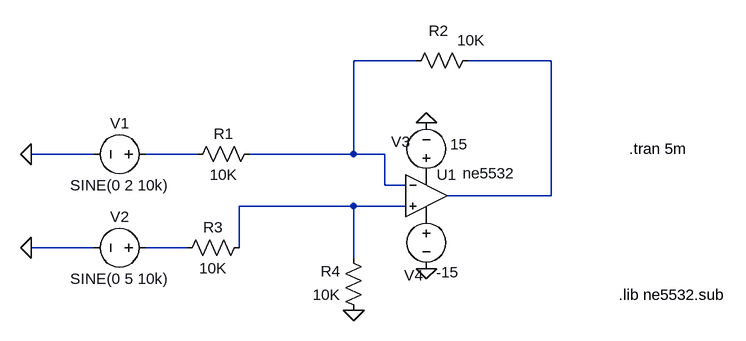
[diagram p0: schematic substractor.asc]
substractor.asc, the LTspice schematic file:
Version 4.1
SHEET 1 880 680
WIRE 160 -48 64 -48
WIRE 368 -48 240 -48
WIRE -336 96 -432 96
WIRE -176 96 -256 96
WIRE 64 96 64 -48
WIRE 64 96 -96 96
WIRE 112 96 64 96
WIRE 112 144 112 96
WIRE 144 144 112 144
WIRE 368 160 368 -48
WIRE 368 160 208 160
WIRE 64 176 -112 176
WIRE 144 176 64 176
WIRE -336 240 -432 240
WIRE -192 240 -256 240
WIRE -112 240 -112 176
WIRE 64 256 64 176
FLAG -432 96 0
FLAG -432 240 0
FLAG 64 336 0
FLAG 176 272 0
FLAG 176 48 0
SYMBOL OpAmps\\opamp2 176 96 R0
WINDOW 3 56 29 Left 2
SYMATTR InstName U1
SYMATTR Value ne5532
SYMBOL res -80 80 R90
WINDOW 0 0 56 VBottom 2
WINDOW 3 32 56 VTop 2
SYMATTR InstName R1
SYMATTR Value 10K
SYMATTR SpiceLine tol=1 pwr=0.1
SYMBOL res 256 -64 R90
WINDOW 0 -14 61 VBottom 2
WINDOW 3 -31 11 VTop 2
SYMATTR InstName R2
SYMATTR Value 10K
SYMATTR SpiceLine tol=1 pwr=0.1
SYMBOL res -96 224 R90
WINDOW 0 0 56 VBottom 2
WINDOW 3 32 56 VTop 2
SYMATTR InstName R3
SYMATTR Value 10K
SYMATTR SpiceLine tol=1 pwr=0.1
SYMBOL res 80 352 R180
WINDOW 0 36 76 Left 2
WINDOW 3 36 40 Left 2
SYMATTR InstName R4
SYMATTR Value 10K
SYMATTR SpiceLine tol=1 pwr=0.1
SYMBOL voltage -240 96 R90
WINDOW 0 -32 56 VBottom 2
WINDOW 3 32 56 VTop 2
WINDOW 123 0 0 Left 0
WINDOW 39 0 0 Left 0
SYMATTR InstName V1
SYMATTR Value SINE(0 2 10k)
SYMBOL voltage -240 240 R90
WINDOW 0 -32 56 VBottom 2
WINDOW 3 32 56 VTop 2
WINDOW 123 0 0 Left 0
WINDOW 39 0 0 Left 0
SYMATTR InstName V2
SYMATTR Value SINE(0 5 10k)
SYMBOL voltage 176 144 R180
WINDOW 0 25 67 Left 2
WINDOW 3 -64 63 Left 2
WINDOW 123 0 0 Left 0
WINDOW 39 0 0 Left 0
SYMATTR InstName V3
SYMATTR Value 15
SYMBOL voltage 176 176 R0
WINDOW 0 -34 106 Left 2
WINDOW 3 15 102 Left 2
WINDOW 123 0 0 Left 0
WINDOW 39 0 0 Left 0
SYMATTR InstName V4
SYMATTR Value -15
TEXT 472 312 Left 2 !.lib ne5532.sub
TEXT 488 88 Left 2 !.tran 5m

The netlist it stands for:
* substractor.asc
X§U1 N004 N001 P001 P002 N002 ne5532  ; pins In+ In- V+ V- OUT
R1 N001 N003 10K tol=1 pwr=0.1
R2 N002 N001 10K tol=1 pwr=0.1
R3 N004 N005 10K tol=1 pwr=0.1
R4 0 N004 10K tol=1 pwr=0.1
V1 N003 0 SINE(0 2 10k)
V2 N005 0 SINE(0 5 10k)
V3 P001 0 15
V4 P002 0 -15
.lib ne5532.sub
.tran 5m
.backanno
.end